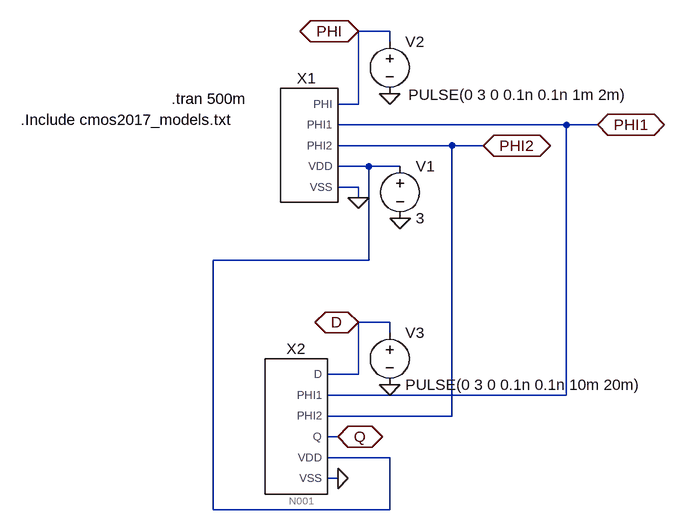
[diagram p0: schematic Shift_Register_CLK_Testbench.asc]
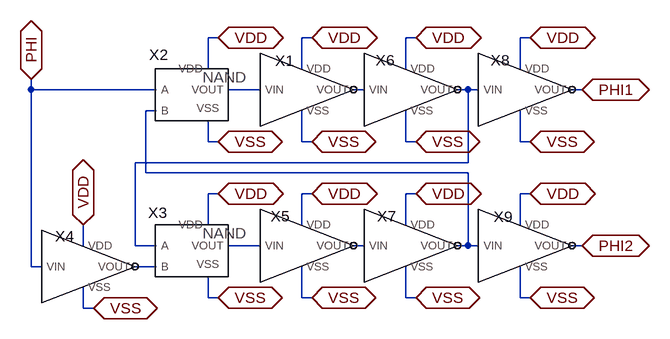
[diagram p1: sub-circuit 2phase_clk.asc]
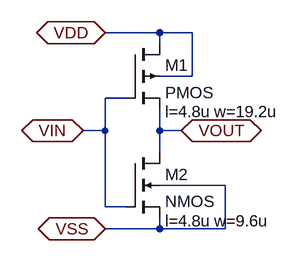
[diagram p2: sub-circuit invertor_jan20.asc]
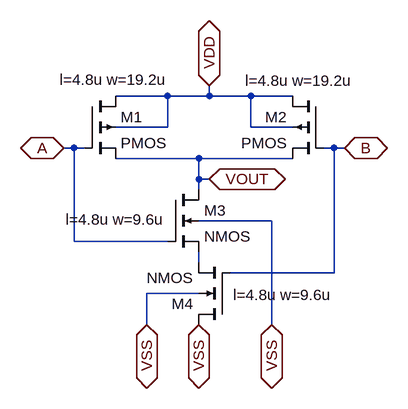
[diagram p3: sub-circuit nand.asc]
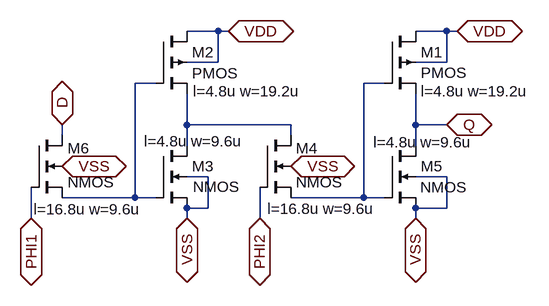
[diagram p4: sub-circuit shift_register.asc]
Shift_Register_CLK_Testbench.asc, the LTspice schematic file:
Version 4
SHEET 1 880 772
WIRE 256 32 208 32
WIRE 256 48 256 32
WIRE 208 144 208 32
WIRE 208 144 176 144
WIRE 528 176 176 176
WIRE 576 176 528 176
WIRE 352 208 176 208
WIRE 400 208 352 208
WIRE 224 240 176 240
WIRE 272 240 224 240
WIRE 208 272 176 272
WIRE 208 288 208 272
WIRE 224 384 224 240
WIRE 224 384 -16 384
WIRE 256 480 208 480
WIRE 256 496 256 480
WIRE 208 560 208 480
WIRE 208 560 160 560
WIRE 528 592 528 176
WIRE 528 592 160 592
WIRE 352 624 352 208
WIRE 352 624 160 624
WIRE 176 656 160 656
WIRE 256 688 160 688
WIRE 176 720 160 720
WIRE -16 768 -16 384
WIRE 256 768 256 688
WIRE 256 768 -16 768
FLAG 208 288 0
FLAG 272 320 0
FLAG 256 128 0
FLAG 576 176 PHI1
IOPIN 576 176 BiDir
FLAG 400 208 PHI2
IOPIN 400 208 BiDir
FLAG 208 32 PHI
IOPIN 208 32 BiDir
FLAG 256 576 0
FLAG 176 720 0
FLAG 176 656 Q
IOPIN 176 656 BiDir
FLAG 208 480 D
IOPIN 208 480 BiDir
SYMBOL 2phase_CLK 128 240 R0
SYMATTR InstName X1
SYMBOL voltage 272 224 R0
WINDOW 123 0 0 Left 2
WINDOW 39 0 0 Left 2
SYMATTR InstName V1
SYMATTR Value 3
SYMBOL voltage 256 32 R0
WINDOW 123 0 0 Left 2
WINDOW 39 0 0 Left 2
WINDOW 3 29 98 Left 2
SYMATTR Value PULSE(0 3 0 0.1n 0.1n 1m 2m)
SYMATTR InstName V2
SYMBOL Shift_Register 112 640 R0
SYMATTR InstName X2
SYMBOL voltage 256 480 R0
WINDOW 123 0 0 Left 2
WINDOW 39 0 0 Left 2
SYMATTR InstName V3
SYMATTR Value PULSE(0 3 0 0.1n 0.1n 10m 20m)
TEXT -80 136 Left 2 !.tran 500m
TEXT -312 168 Left 2 !.Include cmos2017_models.txt

2phase_clk.asc, the sub-circuit schematic file:
Version 4
SHEET 1 1068 816
WIRE 112 80 96 80
WIRE 256 80 240 80
WIRE 416 80 400 80
WIRE 592 80 576 80
WIRE 96 128 96 80
WIRE 240 128 240 80
WIRE 400 128 400 80
WIRE 576 128 576 80
WIRE -176 160 -176 144
WIRE 16 160 -176 160
WIRE 176 160 128 160
WIRE 336 160 320 160
WIRE 496 160 480 160
WIRE 512 160 496 160
WIRE 672 160 656 160
WIRE 16 192 0 192
WIRE 96 240 96 208
WIRE 112 240 96 240
WIRE 240 240 240 192
WIRE 256 240 240 240
WIRE 400 240 400 192
WIRE 416 240 400 240
WIRE 576 240 576 192
WIRE 592 240 576 240
WIRE 496 272 496 160
WIRE 496 272 -16 272
WIRE 0 288 0 192
WIRE 496 288 0 288
WIRE 112 320 96 320
WIRE 256 320 240 320
WIRE 416 320 400 320
WIRE 592 320 576 320
WIRE 96 368 96 320
WIRE 240 368 240 320
WIRE 400 368 400 320
WIRE 576 368 576 320
WIRE -96 400 -96 368
WIRE -16 400 -16 272
WIRE 16 400 -16 400
WIRE 176 400 128 400
WIRE 336 400 320 400
WIRE 496 400 496 288
WIRE 496 400 480 400
WIRE 512 400 496 400
WIRE 672 400 656 400
WIRE -176 432 -176 160
WIRE -160 432 -176 432
WIRE 16 432 -16 432
WIRE 96 480 96 448
WIRE 112 480 96 480
WIRE 240 480 240 432
WIRE 256 480 240 480
WIRE 400 480 400 432
WIRE 416 480 400 480
WIRE 576 480 576 432
WIRE 592 480 576 480
WIRE -96 496 -96 464
WIRE -80 496 -96 496
FLAG 112 80 VDD
IOPIN 112 80 BiDir
FLAG 256 80 VDD
IOPIN 256 80 BiDir
FLAG 416 80 VDD
IOPIN 416 80 BiDir
FLAG 592 80 VDD
IOPIN 592 80 BiDir
FLAG 112 320 VDD
IOPIN 112 320 BiDir
FLAG 256 320 VDD
IOPIN 256 320 BiDir
FLAG 416 320 VDD
IOPIN 416 320 BiDir
FLAG 592 320 VDD
IOPIN 592 320 BiDir
FLAG -96 368 VDD
IOPIN -96 368 BiDir
FLAG 256 240 VSS
IOPIN 256 240 BiDir
FLAG 416 240 VSS
IOPIN 416 240 BiDir
FLAG 592 240 VSS
IOPIN 592 240 BiDir
FLAG -80 496 VSS
IOPIN -80 496 BiDir
FLAG 256 480 VSS
IOPIN 256 480 BiDir
FLAG 416 480 VSS
IOPIN 416 480 BiDir
FLAG 592 480 VSS
IOPIN 592 480 BiDir
FLAG -176 144 PHI
IOPIN -176 144 BiDir
FLAG 672 160 PHI1
IOPIN 672 160 BiDir
FLAG 672 400 PHI2
IOPIN 672 400 BiDir
FLAG 112 240 VSS
IOPIN 112 240 BiDir
FLAG 112 480 VSS
IOPIN 112 480 BiDir
SYMBOL Invertor_Jan20 240 160 R0
WINDOW 0 -26 -29 Bottom 2
SYMATTR InstName X1
SYMBOL nand 64 176 R0
WINDOW 0 -44 -54 Bottom 2
SYMATTR InstName X2
SYMBOL nand 64 416 R0
WINDOW 0 -45 -51 Bottom 2
SYMATTR InstName X3
SYMBOL Invertor_Jan20 -96 432 R0
WINDOW 0 -28 -31 Bottom 2
SYMATTR InstName X4
SYMBOL Invertor_Jan20 240 400 R0
WINDOW 0 -33 -30 Bottom 2
SYMATTR InstName X5
SYMBOL Invertor_Jan20 400 160 R0
WINDOW 0 -31 -30 Bottom 2
SYMATTR InstName X6
SYMBOL Invertor_Jan20 400 400 R0
WINDOW 0 -29 -30 Bottom 2
SYMATTR InstName X7
SYMBOL Invertor_Jan20 576 160 R0
WINDOW 0 -30 -30 Bottom 2
SYMATTR InstName X8
SYMBOL Invertor_Jan20 576 400 R0
WINDOW 0 -26 -29 Bottom 2
SYMATTR InstName X9

invertor_jan20.asc, the sub-circuit schematic file:
Version 4
SHEET 1 880 680
WIRE 192 0 112 0
WIRE 240 0 192 0
WIRE 192 16 192 0
WIRE 240 64 240 0
WIRE 240 64 192 64
WIRE 144 96 112 96
WIRE 112 144 112 96
WIRE 112 144 80 144
WIRE 192 144 192 112
WIRE 224 144 192 144
WIRE 192 176 192 144
WIRE 288 224 192 224
WIRE 112 256 112 144
WIRE 144 256 112 256
WIRE 192 288 192 272
WIRE 192 288 112 288
WIRE 288 288 288 224
WIRE 288 288 192 288
FLAG 80 144 VIN
IOPIN 80 144 BiDir
FLAG 224 144 VOUT
IOPIN 224 144 BiDir
FLAG 112 0 VDD
IOPIN 112 0 BiDir
FLAG 112 288 VSS
IOPIN 112 288 BiDir
SYMBOL pmos4 144 16 R0
WINDOW 123 56 100 Left 2
SYMATTR Value2 l=4.8u w=19.2u
SYMATTR InstName M1
SYMBOL nmos4 144 176 R0
WINDOW 123 56 100 Left 2
SYMATTR Value2 l=4.8u w=9.6u
SYMATTR InstName M2

nand.asc, the sub-circuit schematic file:
Version 4
SHEET 1 880 680
WIRE 208 32 128 32
WIRE 272 32 272 16
WIRE 272 32 208 32
WIRE 336 32 272 32
WIRE 400 32 336 32
WIRE 208 80 208 32
WIRE 208 80 128 80
WIRE 336 80 336 32
WIRE 400 80 336 80
WIRE 64 112 48 112
WIRE 80 112 64 112
WIRE 464 112 448 112
WIRE 480 112 464 112
WIRE 256 128 128 128
WIRE 400 128 256 128
WIRE 256 160 256 128
WIRE 272 160 256 160
WIRE 256 176 256 160
WIRE 368 224 256 224
WIRE 64 256 64 112
WIRE 208 256 64 256
WIRE 256 288 256 272
WIRE 464 304 464 112
WIRE 464 304 304 304
WIRE 256 336 176 336
WIRE 176 384 176 336
WIRE 368 384 368 224
FLAG 256 384 VSS
IOPIN 256 384 BiDir
FLAG 48 112 A
IOPIN 48 112 BiDir
FLAG 480 112 B
IOPIN 480 112 BiDir
FLAG 176 384 VSS
IOPIN 176 384 BiDir
FLAG 272 16 VDD
IOPIN 272 16 BiDir
FLAG 368 384 VSS
IOPIN 368 384 BiDir
FLAG 272 160 VOUT
IOPIN 272 160 BiDir
SYMBOL pmos4 80 32 R0
WINDOW 123 -38 -25 Left 2
SYMATTR Value2 l=4.8u w=19.2u
SYMATTR InstName M1
SYMBOL pmos4 448 32 M0
WINDOW 123 -45 -24 Left 2
SYMATTR Value2 l=4.8u w=19.2u
SYMATTR InstName M2
SYMBOL nmos4 208 176 R0
WINDOW 123 -157 46 Left 2
SYMATTR Value2 l=4.8u w=9.6u
SYMATTR InstName M3
SYMBOL nmos4 304 384 R180
WINDOW 123 -157 46 Left 2
SYMATTR Value2 l=4.8u w=9.6u
SYMATTR InstName M4

shift_register.asc, the sub-circuit schematic file:
Version 4
SHEET 1 880 680
WIRE -112 48 -160 48
WIRE -96 48 -112 48
WIRE 240 48 192 48
WIRE 256 48 240 48
WIRE -112 96 -112 48
WIRE -112 96 -160 96
WIRE 240 96 240 48
WIRE 240 96 192 96
WIRE -208 128 -240 128
WIRE 144 128 112 128
WIRE -160 192 -160 144
WIRE 0 192 -160 192
WIRE 192 192 192 144
WIRE 240 192 192 192
WIRE -352 208 -352 192
WIRE 0 208 0 192
WIRE -160 224 -160 192
WIRE 192 224 192 192
WIRE -128 272 -160 272
WIRE 240 272 192 272
WIRE -240 304 -240 128
WIRE -240 304 -352 304
WIRE -208 304 -240 304
WIRE 112 304 112 128
WIRE 112 304 0 304
WIRE 144 304 112 304
WIRE -128 320 -128 272
WIRE -128 320 -160 320
WIRE 240 320 240 272
WIRE 240 320 192 320
WIRE -400 336 -400 288
WIRE -160 336 -160 320
WIRE -48 336 -48 288
WIRE 192 336 192 320
FLAG -400 336 PHI1
IOPIN -400 336 BiDir
FLAG -48 336 PHI2
IOPIN -48 336 BiDir
FLAG -352 192 D
IOPIN -352 192 BiDir
FLAG -96 48 VDD
IOPIN -96 48 BiDir
FLAG 256 48 VDD
IOPIN 256 48 BiDir
FLAG -160 336 VSS
IOPIN -160 336 BiDir
FLAG 192 336 VSS
IOPIN 192 336 BiDir
FLAG 240 192 Q
IOPIN 240 192 BiDir
FLAG -352 256 VSS
IOPIN -352 256 BiDir
FLAG 0 256 VSS
IOPIN 0 256 BiDir
SYMBOL pmos4 144 48 R0
WINDOW 123 56 92 Left 2
WINDOW 3 56 64 Left 2
SYMATTR Value2 l=4.8u w=19.2u
SYMATTR InstName M1
SYMBOL pmos4 -208 48 R0
WINDOW 123 57 92 Left 2
WINDOW 3 56 65 Left 2
SYMATTR Value2 l=4.8u w=19.2u
SYMATTR InstName M2
SYMBOL nmos4 -208 224 R0
WINDOW 123 -18 -7 Left 2
WINDOW 3 57 63 Left 2
SYMATTR Value2 l=4.8u w=9.6u
SYMATTR InstName M3
SYMBOL nmos4 -48 208 R0
WINDOW 123 12 113 Left 2
WINDOW 0 56 20 Left 2
SYMATTR Value2 l=16.8u w=9.6u
SYMATTR InstName M4
SYMBOL nmos4 144 224 R0
WINDOW 123 -17 -5 Left 2
WINDOW 3 55 64 Left 2
SYMATTR Value2 l=4.8u w=9.6u
SYMATTR InstName M5
SYMBOL nmos4 -400 208 R0
WINDOW 123 4 114 Left 2
WINDOW 0 56 20 Left 2
SYMATTR Value2 l=16.8u w=9.6u
SYMATTR InstName M6

The netlist it stands for:
* Shift_Register_CLK_Testbench.asc
XX1 PHI PHI1 PHI2 N001 0 2phase_clk
V1 N001 0 3
V2 PHI 0 PULSE(0 3 0 0.1n 0.1n 1m 2m)
XX2 D PHI1 PHI2 Q N001 0 shift_register
V3 D 0 PULSE(0 3 0 0.1n 0.1n 10m 20m)

* block symbol definitions
.subckt 2phase_clk PHI PHI1 PHI2 VDD VSS
XX1 VDD N001 VSS N002 invertor_jan20
XX2 PHI N004 VDD N001 VSS nand
XX3 N003 N007 VDD N005 VSS nand
XX4 VDD PHI VSS N007 invertor_jan20
XX5 VDD N005 VSS N006 invertor_jan20
XX6 VDD N002 VSS N003 invertor_jan20
XX7 VDD N006 VSS N004 invertor_jan20
XX8 VDD N003 VSS PHI1 invertor_jan20
XX9 VDD N004 VSS PHI2 invertor_jan20
.ends 2phase_clk

.subckt invertor_jan20 VDD VIN VSS VOUT
M1 VDD VIN VOUT VDD PMOS l=4.8u w=19.2u
M2 VOUT VIN VSS VSS NMOS l=4.8u w=9.6u
.ends invertor_jan20

.subckt nand A B VDD VOUT VSS
M1 VDD A VOUT VDD PMOS l=4.8u w=19.2u
M2 VDD B VOUT VDD PMOS l=4.8u w=19.2u
M3 VOUT A N001 VSS NMOS l=4.8u w=9.6u
M4 VSS B N001 VSS NMOS l=4.8u w=9.6u
.ends nand

.subckt shift_register D PHI1 PHI2 Q VDD VSS
M1 VDD N002 Q VDD PMOS l=4.8u w=19.2u
M2 VDD N001 N003 VDD PMOS l=4.8u w=19.2u
M3 N003 N001 VSS VSS NMOS l=4.8u w=9.6u
M4 N003 PHI2 N002 VSS NMOS l=16.8u w=9.6u
M5 Q N002 VSS VSS NMOS l=4.8u w=9.6u
M6 D PHI1 N001 VSS NMOS l=16.8u w=9.6u
.ends shift_register

.model NMOS NMOS
.model PMOS PMOS
.lib standard.mos
.tran 500m
.Include cmos2017_models.txt
.backanno
.end

* Results of the author's LTspice run, read from the files saved beside the schematic
* Operating Point, zero values left out:
*   V(n001) = 3 V
*   V(phi1) = 1.068 µV
*   V(phi2) = 3 V
*   V(q) = 1.171 µV
*   I(V1) = -2.22 nA
*   Ix(x1:VDD) = 1.749 nA
*   Ix(x1:VSS) = -1.31 nA
*   Ix(x2:VDD) = 471.5 pA
*   Ix(x2:VSS) = -471.5 pA